# EAGLE schematic RAMPS_1-41 (EAGLE 5.11)
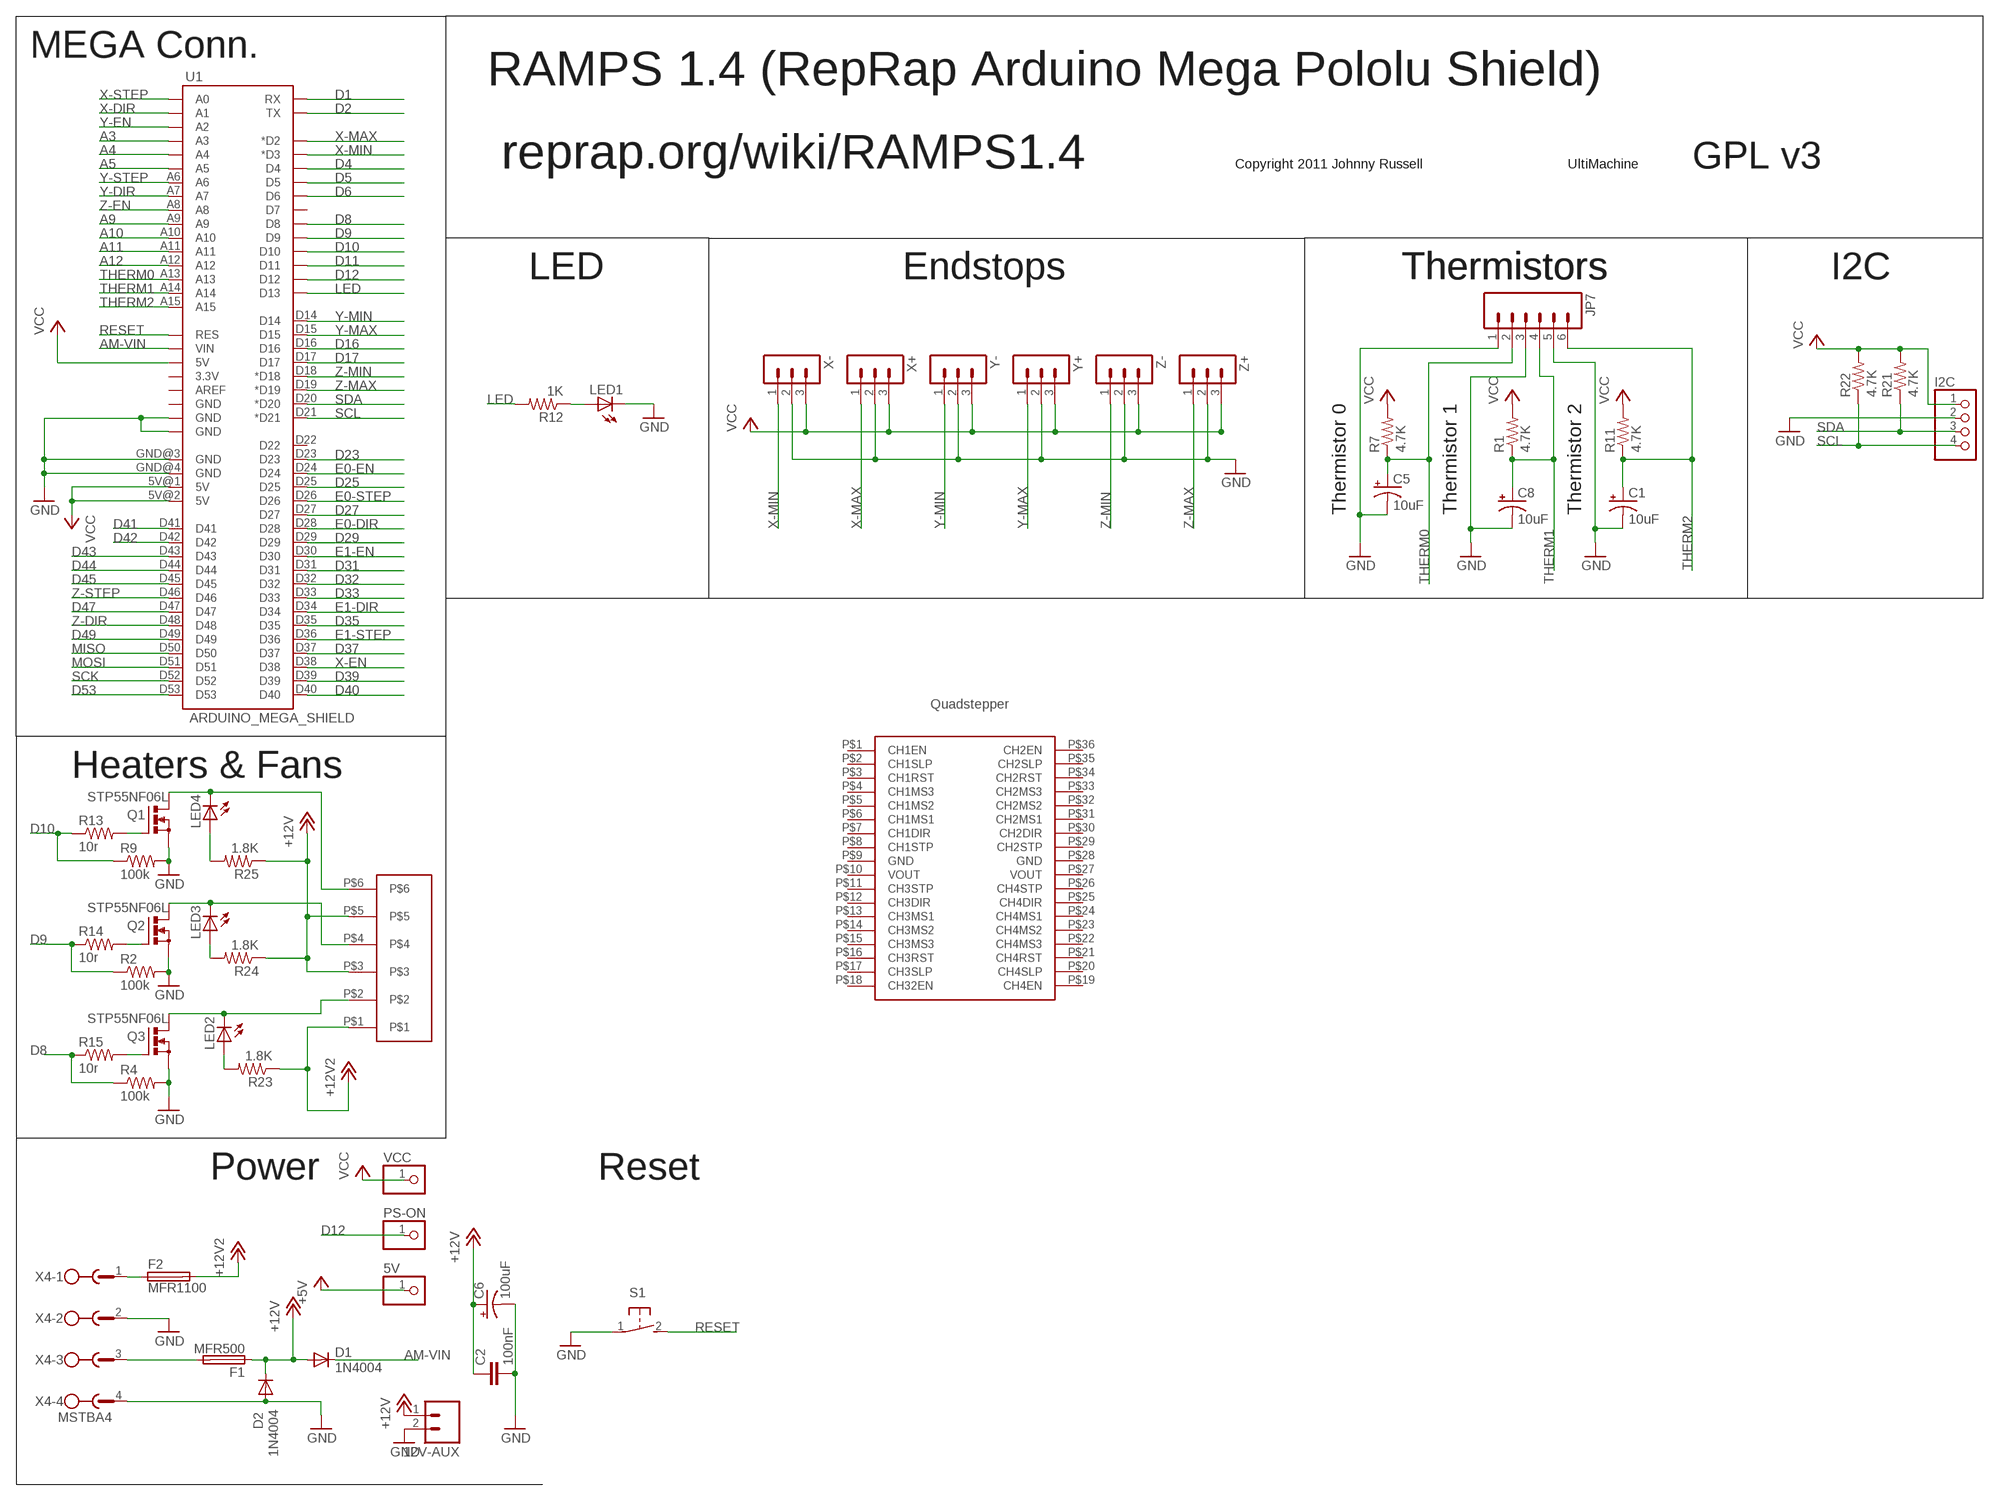
[diagram p0: schematic, sheet 1]

## Parts
5V  PINHD-1X1  [1X01]
12V-AUX  M02PTH  [1X02]
C1  10uF  CPOL-US153CLV-0405  [153CLV-0405]
C2  100nF  C-EUC0805  [C0805]
C5  10uF  CPOL-US153CLV-0405  [153CLV-0405]
C6  100uF  CPOL-US153CLV-0605  [153CLV-0605]
C8  10uF  CPOL-US153CLV-0405  [153CLV-0405]
D1  1N4004  [DO41-10]
D2  1N4004  [DO41-10]
F1  MFR500  PTCFUSE  [MFR500]
F2  MFR1100  PTCFUSEMFR1100  [MFR1100]
I2C  PINHD-1X4  [1X04]
JP7  M06SIP  [1X06]
LED1  LEDCHIP-LED0805  [CHIP-LED0805]
LED2  LEDCHIP-LED0805  [CHIP-LED0805]
LED3  LEDCHIP-LED0805  [CHIP-LED0805]
LED4  LEDCHIP-LED0805  [CHIP-LED0805]
PS-ON  PINHD-1X1  [1X01]
Q1  STP55NF06L  IRF512  [TO220BV]
Q2  STP55NF06L  IRF512  [TO220BV]
Q3  STP55NF06L  IRF512  [TO220BV]
R1  4.7K  R-US_R0805  [R0805]
R2  100k  R-US_R0805  [R0805]
R4  100k  R-US_R0805  [R0805]
R7  4.7K  R-US_R0805  [R0805]
R9  100k  R-US_R0805  [R0805]
R11  4.7K  R-US_R0805  [R0805]
R12  1K  R-US_R0805  [R0805]
R13  10r  R-US_R0805  [R0805]
R14  10r  R-US_M0805  [M0805]
R15  10r  R-US_R0805  [R0805]
R21  4.7K  R-US_R0805  [R0805]
R22  4.7K  R-US_R0805  [R0805]
R23  1.8K  R-US_R0805  [R0805]
R24  1.8K  R-US_R0805  [R0805]
R25  1.8K  R-US_R0805  [R0805]
S1  31-XX  [B3F-31XX]
U1  ARDUINO_MEGA_SHIELD  [ARDUINO_MEGA_SHIELD]
U$1  QUADSTEPPER  [QUADSTEP18X2]
U$2  282837-6  [282837-6]
VCC  PINHD-1X1  [1X01]
X4  MSTBA4  [MSTBA4]
X+  3PIN-HEADER  [3PIN-HEADER]
X-  3PIN-HEADER  [3PIN-HEADER]
Y+  3PIN-HEADER  [3PIN-HEADER]
Y-  3PIN-HEADER  [3PIN-HEADER]
Z+  3PIN-HEADER  [3PIN-HEADER]
Z-  3PIN-HEADER  [3PIN-HEADER]

## Nets
+5V: 5V.1
+12V: 12V-AUX.1 C2.1 C6.+ D1.A D2.C F1.1 R24.1 R25.1 U$2.P$3 U$2.P$5
+12V2: F2.2 R23.1 U$2.P$1
A3: U1.A3
A4: U1.A4
A5: U1.A5
A9: U1.A9
A10: U1.A10
A11: U1.A11
A12: U1.A12
AM-VIN: D1.C U1.VIN
D1: U1.RX
D2: U1.TX
D4: U1.D4
D5: U1.D5
D6: U1.D6
D8: R4.1 R15.1 U1.D8
D9: R2.1 R14.1 U1.D9
D10: R9.1 R13.1 U1.D10
D11: U1.D11
D12: PS-ON.1 U1.D12
D16: U1.D16
D17: U1.D17
D23: U1.D23
D25: U1.D25
D27: U1.D27
D29: U1.D29
D31: U1.D31
D32: U1.D32
D33: U1.D33
D35: U1.D35
D37: U1.D37
D39: U1.D39
D40: U1.D40
D41: U1.D41
D42: U1.D42
D43: U1.D43
D44: U1.D44
D45: U1.D45
D47: U1.D47
D49: U1.D49
D53: U1.D53
E0-DIR: U1.D28
E0-EN: U1.D24
E0-STEP: U1.D26
E1-DIR: U1.D34
E1-EN: U1.D30
E1-STEP: U1.D36
GND: 12V-AUX.2 C1.- C2.2 C5.- C6.- C8.- D2.A I2C.2 JP7.1 JP7.3 JP7.5 LED1.C Q1.S Q2.S Q3.S R2.2 R4.2 R9.2 S1.1(P) U1.GND@0(GND) U1.GND@1(GND) U1.GND@3(GND) U1.GND@4(GND) X4.2 X4.4 X+.2 X-.2 Y+.2 Y-.2 Z+.2 Z-.2
LED: R12.2 U1.D13
MISO: U1.D50
MOSI: U1.D51
N$1: LED3.C Q2.D U$2.P$4
N$7: LED4.C Q1.D U$2.P$6
N$32: LED2.A R23.2
N$45: LED3.A R24.2
N$46: LED1.A R12.1
N$47: Q2.G R14.2
N$48: Q1.G R13.2
N$49: Q3.G R15.2
N$50: LED4.A R25.2
N$51: LED2.C Q3.D U$2.P$2
N$53: F2.1 X4.1
N$54: F1.2 X4.3
RESET: S1.2(S) U1.RES
SCK: U1.D52
SCL: I2C.4 R22.1 U1.D21(*D21)
SDA: I2C.3 R21.1 U1.D20(*D20)
THERM0: C5.+ JP7.2 R7.1 U1.A13
THERM1: C8.+ JP7.4 R1.1 U1.A14
THERM2: C1.+ JP7.6 R11.1 U1.A15
VCC: I2C.1 R1.2 R7.2 R11.2 R21.2 R22.2 U1.5V@0(5V) U1.5V@1(5V) U1.5V@2(5V) VCC.1 X+.3 X-.3 Y+.3 Y-.3 Z+.3 Z-.3
X-DIR: U1.A1
X-EN: U1.D38
X-MAX: U1.D2(*D2) X+.1
X-MIN: U1.D3(*D3) X-.1
X-STEP: U1.A0
Y-DIR: U1.A7
Y-EN: U1.A2
Y-MAX: U1.D15 Y+.1
Y-MIN: U1.D14 Y-.1
Y-STEP: U1.A6
Z-DIR: U1.D48
Z-EN: U1.A8
Z-MAX: U1.D19(*D19) Z+.1
Z-MIN: U1.D18(*D18) Z-.1
Z-STEP: U1.D46
Unconnected: U1.3.3V U1.AREF U1.D7 U1.D22 U1.GND@2(GND) U$1.P$1(CH1EN) U$1.P$2(CH1SLP) U$1.P$3(CH1RST) U$1.P$4(CH1MS3) U$1.P$5(CH1MS2) U$1.P$6(CH1MS1) U$1.P$7(CH1DIR) U$1.P$8(CH1STP) U$1.P$9(GND) U$1.P$10(VOUT) U$1.P$11(CH3STP) U$1.P$12(CH3DIR) U$1.P$13(CH3MS1) U$1.P$14(CH3MS2) U$1.P$15(CH3MS3) U$1.P$16(CH3RST) U$1.P$17(CH3SLP) U$1.P$18(CH32EN) U$1.P$19(CH4EN) U$1.P$20(CH4SLP) U$1.P$21(CH4RST) U$1.P$22(CH4MS3) U$1.P$23(CH4MS2) U$1.P$24(CH4MS1) U$1.P$25(CH4DIR) U$1.P$26(CH4STP) U$1.P$27(VOUT) U$1.P$28(GND) U$1.P$29(CH2STP) U$1.P$30(CH2DIR) U$1.P$31(CH2MS1) U$1.P$32(CH2MS2) U$1.P$33(CH2MS3) U$1.P$34(CH2RST) U$1.P$35(CH2SLP) U$1.P$36(CH2EN)

## Notes on the sheet
- MEGA Conn.
- RAMPS 1.4 (RepRap Arduino Mega Pololu Shield)
- reprap.org/wiki/RAMPS1.4 | Copyright 2011 Johnny Russell | UltiMachine | GPL v3
- LED | Endstops | Thermistors | Thermistors | I2C
- Thermistor 0 | Thermistor 1 | Thermistor 2
- Quadstepper
- Heaters & Fans
- Power | Reset

## Library data of the parts
5V PS-ON VCC = adafruit:PINHD-1X1: Pin header 1x1 for 0.1" spacing With round pins
12V-AUX = SparkFun:M02: Header 2 Standard 2-pin 0.1" header. Use with straight break away headers (SKU : PRT-00116), right angle break away headers (PRT-00553), swiss pins (PRT-00743), machine pins (PRT-00117), and female headers (PRT-00115). Molex polarized connector foot print use with SKU : PRT-08233 with associated crimp pins and housings.
C1 C5 C6 C8 = adafruit:CPOL-US: POLARIZED CAPACITOR, American symbol
C2 = resistor:C-EU: CAPACITOR, European symbol
D1 D2 = diode:1N4004: DIODE general purpose rectifier, 1 A
F1 F2 = RepRapjr:PTCFUSE: LITTLEFUSE Picofuse/slow Littlefuse
I2C = RepRapjr:PINHD-1X4: PIN HEADER
JP7 = SparkFun:M06: Header 6 Standard 6-pin 0.1" header. Use with straight break away headers (SKU : PRT-00116), right angle break away headers (PRT-00553), swiss pins (PRT-00743), machine pins (PRT-00117), and female headers (PRT-00115). Molex polarized connector foot print use with SKU : PRT-08094 with associated crimp pins and housings. NOTES ON THE VARIANTS LOCK and LOCK_LONGPADS... This footprint was designed to help hold the alignment of a through-hole component (i.e. 6-pin header) while soldering it into place. You may notice that each hole has been shifted either up or down by 0.005 of an inch from it's more standard position (which is a perfectly straight line). This slight alteration caused the pins (the squares in the middle) to touch the edges of the holes. Because they are alternating, it causes a "brace" to hold the component in place. 0.005 has proven to be the perfect amount of "off-center" position when using our standard breakaway headers. Although looks a little odd when you look at the bare footprint, once you have a header in there, the alteration is very hard to notice. Also, if you push a header all the way into place, it is covered up entirely on the bottom side. This idea of altering the position of holes to aid alignment will be further integrated into the Sparkfun Library for other footprints. It can help hold any component with 3 or more connection pins.
LED1-LED4 = led:LED: LED OSRAM: - CHIPLED LG R971, LG N971, LY N971, LG Q971, LY Q971, LO R971, LY R971 LH N974, LH R974 LS Q976, LO Q976, LY Q976 LO Q996 - Hyper CHIPLED LW Q18S LB Q993, LB Q99A, LB R99A - SideLED LS A670, LO A670, LY A670, LG A670, LP A670 LB A673, LV A673, LT A673, LW A673 LH A674 LY A675 LS A676, LA A676, LO A676, LY A676, LW A676 LS A679, LY A679, LG A679 - Hyper Micro SIDELED® LS Y876, LA Y876, LO Y876, LY Y876 LT Y87S - SmartLED LW L88C, LW L88S LB L89C, LB L89S, LG L890 LS L89K, LO L89K, LY L89K LS L896, LA L896, LO L896, LY L896 - TOPLED LS T670, LO T670, LY T670, LG T670, LP T670 LSG T670, LSP T670, LSY T670, LOP T670, LYG T670 LG T671, LOG T671, LSG T671 LB T673, LV T673, LT T673, LW T673 LH T674 LS T676, LA T676, LO T676, LY T676, LB T676, LH T676, LSB T676, LW T676 LB T67C, LV T67C, LT T67C, LS T67K, LO T67K, LY T67K, LW E67C LS E67B, LA E67B, LO E67B, LY E67B, LB E67C, LV E67C, LT E67C LW T67C LS T679, LY T679, LG T679 LS T770, LO T770, LY T770, LG T770, LP T770 LB T773, LV T773, LT T773, LW T773 LH T774 LS E675, LA E675, LY E675, LS T675 LS T776, LA T776, LO T776, LY T776, LB T776 LHGB T686 LT T68C, LB T68C - Hyper Mini TOPLED® LB M676 - Mini TOPLED Santana® LG M470 LS M47K, LO M47K, LY M47K Source: http://www.osram.convergy.de LUXEON: - LUMILED® LXK2-PW12-R00, LXK2-PW12-S00, LXK2-PW14-U00, LXK2-PW14-V00 LXK2-PM12-R00, LXK2-PM12-S00, LXK2-PM14-U00 LXK2-PE12-Q00, LXK2-PE12-R00, LXK2-PE12-S00, LXK2-PE14-T00, LXK2-PE14-U00 LXK2-PB12-K00, LXK2-PB12-L00, LXK2-PB12-M00, LXK2-PB14-N00, LXK2-PB14-P00, LXK2-PB14-Q00 LXK2-PR12-L00, LXK2-PR12-M00, LXK2-PR14-Q00, LXK2-PR14-R00 LXK2-PD12-Q00, LXK2-PD12-R00, LXK2-PD12-S00 LXK2-PH12-R00, LXK2-PH12-S00 LXK2-PL12-P00, LXK2-PL12-Q00, LXK2-PL12-R00 Source: www.luxeon.com KINGBRIGHT: KA-3528ASYC Source: www.kingbright.com
Q1-Q3 = transistor-power:IRF512: N-CHANNEL MOS FET
R1 R2 R4 R7 R9 R11 R12 R21-R25 = adafruit:R-US_: RESISTOR, American symbol
R13-R15 = resistor:R-US_: RESISTOR, American symbol
S1 = switch-omron:31-XX: OMRON SWITCH; MPN: B3F-3100; OC_FARNELL: 959704; OC_NEWARK: 36M3582
U1 = RepRapjr:ARDUINO_MEGA_SHIELD
U$1 = ajray:QUADSTEPPER
U$2 = RepRapjr:282837-6
X4 = con-phoenix-508:MSTBA4: PHOENIX
X+ X- Y+ Y- Z+ Z- = ultimachine:3PIN-HEADER: PIN HEADER